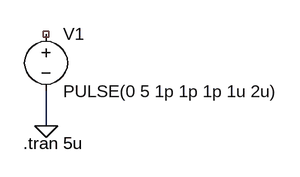
[diagram p0: schematic Draft5.asc]
Draft5.asc, the LTspice schematic file:
Version 4
SHEET 1 880 680
WIRE 144 240 144 192
FLAG 144 240 0
SYMBOL voltage 144 96 R0
WINDOW 123 0 0 Left 0
WINDOW 39 0 0 Left 0
SYMATTR InstName V1
SYMATTR Value PULSE(0 5 1p 1p 1p 1u 2u)
TEXT 112 264 Left 2 !.tran 5u

The netlist it stands for:
* Draft5.asc
V1 NC_01 0 PULSE(0 5 1p 1p 1p 1u 2u)
.tran 5u
.backanno
.end